# Altium project LPCB219__RLOOP__CONTROL_NODE.PrjPCB
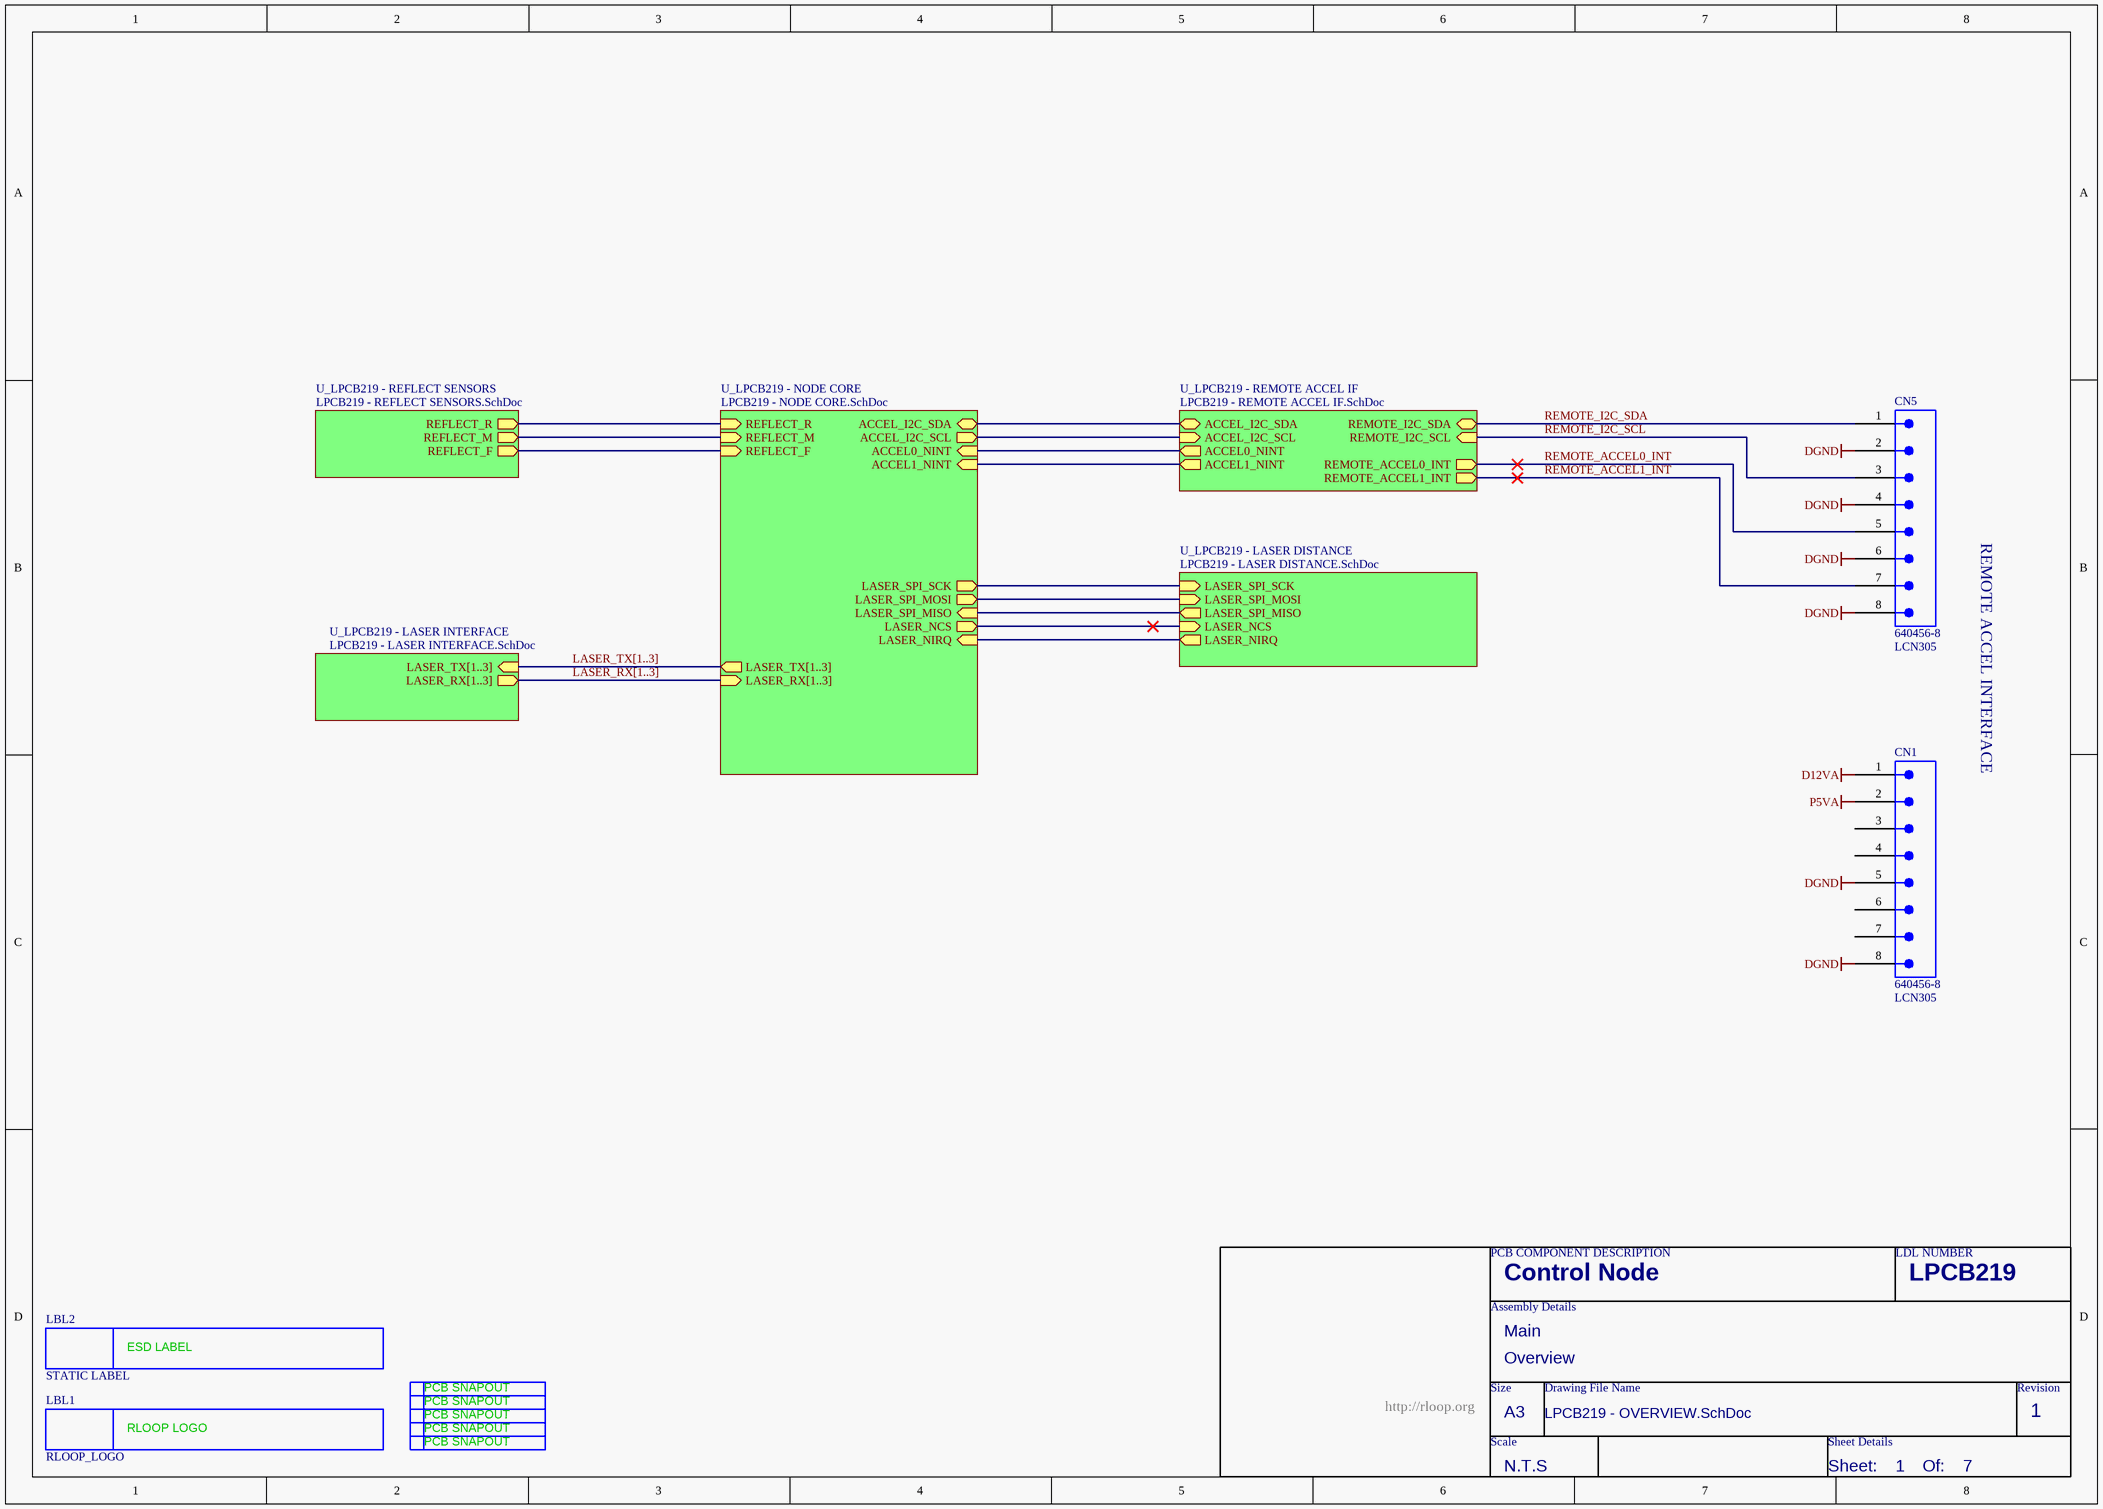
[diagram p0: LPCB219 - OVERVIEW.SchDoc]
7 sheets, 85 parts. Net scope: hierarchical (ports join the sheet entries above them; power ports are global).
Board files: LPCB219R0.PcbDoc, LPCB219R0__ASCII.PcbDoc
Sheets:
  LPCB219 - OVERVIEW.SchDoc
    U_LPCB219 - LASER INTERFACE = LPCB219 - LASER INTERFACE.SchDoc
      L1 = LPCB219 - LASER CHANNEL.SchDoc
      L2 = LPCB219 - LASER CHANNEL.SchDoc
      L3 = LPCB219 - LASER CHANNEL.SchDoc
    U_LPCB219 - REFLECT SENSORS = LPCB219 - REFLECT SENSORS.SchDoc
    U_LPCB219 - LASER DISTANCE = LPCB219 - LASER DISTANCE.SchDoc
    U_LPCB219 - NODE CORE = LPCB219 - NODE CORE.SchDoc
    U_LPCB219 - REMOTE ACCEL IF = LPCB219 - REMOTE ACCEL IF.SchDoc

## Sheet LPCB219 - OVERVIEW.SchDoc
size A3; Address1: Factory 10; Address2: 9-13 Dingley Avenue, Dandeong, VICTORIA 3175, AUSTRALIA; DocumentNumber: 1; Revision: 1; SheetNumber: 1; SheetTotal: 7; Lockie__PCB_SUB_ASSEMBLY: Overview; Lockie__PCB_ASSEMBLY: Main; Lockie__LDL: LPCB219; Lockie__PCB_DESCRIPTION: Control Node

### Parts
CN1  640456-8  LDL_NUMBER: LCN305  [640456-8]
CN5  640456-8  LDL_NUMBER: LCN305  [640456-8]
LBL1  RLOOP_LOGO  [RLOOP_LOGO]  (no BOM)
LBL2  STATIC LABEL  [STATIC_LABEL]  (no BOM)
SN2  PCB_SNAPOUT  [SNAPOUT_NEW]  (value not drawn)  (no BOM)
SN3  PCB_SNAPOUT  [SNAPOUT_NEW]  (value not drawn)  (no BOM)
SN4  PCB_SNAPOUT  [SNAPOUT_NEW]  (value not drawn)  (no BOM)
SN5  PCB_SNAPOUT  [SNAPOUT_NEW]  (value not drawn)  (no BOM)
SN6  PCB_SNAPOUT  [SNAPOUT_NEW]  (value not drawn)  (no BOM)

### Sub-sheets
U_LPCB219 - LASER DISTANCE = LPCB219 - LASER DISTANCE.SchDoc: LASER_NIRQ (out), LASER_NCS (in), LASER_SPI_SCK (in), LASER_SPI_MOSI (in), LASER_SPI_MISO (out)
U_LPCB219 - LASER INTERFACE = LPCB219 - LASER INTERFACE.SchDoc: LASER_TX[1..3] (in), LASER_RX[1..3] (out)
U_LPCB219 - NODE CORE = LPCB219 - NODE CORE.SchDoc: ACCEL_I2C_SDA (bidir), ACCEL_I2C_SCL (out), LASER_SPI_MOSI (out), LASER_SPI_MISO (in), LASER_SPI_SCK (out), ACCEL0_NINT (in), ACCEL1_NINT (in), REFLECT_R (in), LASER_NCS (out), LASER_NIRQ (in), REFLECT_M (in), REFLECT_F (in), LASER_TX[1..3] (out), LASER_RX[1..3] (in)
U_LPCB219 - REFLECT SENSORS = LPCB219 - REFLECT SENSORS.SchDoc: REFLECT_R (out), REFLECT_M (out), REFLECT_F (out)
U_LPCB219 - REMOTE ACCEL IF = LPCB219 - REMOTE ACCEL IF.SchDoc: REMOTE_I2C_SDA (bidir), REMOTE_I2C_SCL (in), ACCEL_I2C_SCL (in), ACCEL_I2C_SDA (bidir), ACCEL0_NINT (out), ACCEL1_NINT (out), REMOTE_ACCEL0_INT (out), REMOTE_ACCEL1_INT (out)

### Nets
D12VA: CN1.1
DGND: CN1.5 CN1.8 CN5.2 CN5.4 CN5.6 CN5.8
P5VA: CN1.2
ACCEL0_NINT: sheet U_LPCB219 - NODE CORE/ACCEL0_NINT, sheet U_LPCB219 - REMOTE ACCEL IF/ACCEL0_NINT
ACCEL1_NINT: sheet U_LPCB219 - NODE CORE/ACCEL1_NINT, sheet U_LPCB219 - REMOTE ACCEL IF/ACCEL1_NINT
ACCEL_I2C_SCL: sheet U_LPCB219 - NODE CORE/ACCEL_I2C_SCL, sheet U_LPCB219 - REMOTE ACCEL IF/ACCEL_I2C_SCL
ACCEL_I2C_SDA: sheet U_LPCB219 - NODE CORE/ACCEL_I2C_SDA, sheet U_LPCB219 - REMOTE ACCEL IF/ACCEL_I2C_SDA
LASER_NCS: sheet U_LPCB219 - LASER DISTANCE/LASER_NCS, sheet U_LPCB219 - NODE CORE/LASER_NCS
LASER_SPI_MISO: sheet U_LPCB219 - LASER DISTANCE/LASER_SPI_MISO, sheet U_LPCB219 - NODE CORE/LASER_SPI_MISO
LASER_SPI_MOSI: sheet U_LPCB219 - LASER DISTANCE/LASER_SPI_MOSI, sheet U_LPCB219 - NODE CORE/LASER_SPI_MOSI
LASER_SPI_SCK: sheet U_LPCB219 - LASER DISTANCE/LASER_SPI_SCK, sheet U_LPCB219 - NODE CORE/LASER_SPI_SCK
REMOTE_ACCEL0_INT: CN5.5 ; sheet U_LPCB219 - REMOTE ACCEL IF/REMOTE_ACCEL0_INT
REMOTE_ACCEL1_INT: CN5.7 ; sheet U_LPCB219 - REMOTE ACCEL IF/REMOTE_ACCEL1_INT
REMOTE_I2C_SCL: CN5.3 ; sheet U_LPCB219 - REMOTE ACCEL IF/REMOTE_I2C_SCL
REMOTE_I2C_SDA: CN5.1 ; sheet U_LPCB219 - REMOTE ACCEL IF/REMOTE_I2C_SDA
NetCN4_T20: sheet U_LPCB219 - REFLECT SENSORS/REFLECT_R, sheet U_LPCB219 - NODE CORE/REFLECT_R
NetCN4_T22: sheet U_LPCB219 - LASER DISTANCE/LASER_NIRQ, sheet U_LPCB219 - NODE CORE/LASER_NIRQ
NetCN4_T24: sheet U_LPCB219 - REFLECT SENSORS/REFLECT_M, sheet U_LPCB219 - NODE CORE/REFLECT_M
NetCN4_T27: sheet U_LPCB219 - REFLECT SENSORS/REFLECT_F, sheet U_LPCB219 - NODE CORE/REFLECT_F

Not connected (* = marked no-connect by the designer): CN1 3 4 6 7

### Buses and harness runs
bus LASER_RX[1..3] = sheet U_LPCB219 - LASER INTERFACE/LASER_RX[1..3] = sheet U_LPCB219 - NODE CORE/LASER_RX[1..3]
bus LASER_TX[1..3] = sheet U_LPCB219 - LASER INTERFACE/LASER_TX[1..3] = sheet U_LPCB219 - NODE CORE/LASER_TX[1..3]

### Notes on the sheet
- REMOTE ACCEL INTERFACE
- PCB COMPONENT DESCRIPTION
- LDL NUMBER
- Assembly Details
- Size
- Drawing File Name
- Revision
- http://rloop.org
- Scale
- A3
- Sheet Details
- N.T.S
- Sheet:
- Of:
- (in symbol PCB_SNAPOUT) PCB SNAPOUT
- (in symbol RLOOP_LOGO) RLOOP LOGO
- (in symbol STATIC LABEL) ESD LABEL

### Library data of the parts
CN1 CN5 = 640456-8: Connector, Male Header, 8 Way; FMEDA__CHANNEL: COM; FMEDA__OPERATING__CURRENT_MAX: 0; FMEDA__OPERATING__TEMP_MAX: 50; FMEDA__OPERATING__TEMP_MIN: -20; FMEDA__OPERATING__TEMP_TYP: 27; FMEDA__OPERATING__VOLTAGE_MAX: 16; FMEDA__OPERATING__VOLTAGE_TYP: 12; FMEDA__FUNCTION_IN_SYSTEM: *; FMEDA__OPERATING__CURRENT_MIN: 0; FMEDA__OPERATING__CURRENT_TYP: 0; FMEDA__OPERATING__VOLTAGE_MIN: 0
LBL1 = RLOOP_LOGO: FMEDA__CHANNEL: DIAG; FMEDA__FUNCTION_IN_SYSTEM: *
LBL2 = STATIC LABEL: FMEDA__CHANNEL: DIAG; FMEDA__FUNCTION_IN_SYSTEM: *
SN2-SN6 = PCB_SNAPOUT: FMEDA__CHANNEL: DIAG; FMEDA__FUNCTION_IN_SYSTEM: *

## Sheet LPCB219 - LASER INTERFACE.SchDoc
size A3; Address1: Factory 10; Address2: 9-13 Dingley Avenue, Dandeong, VICTORIA 3175, AUSTRALIA; DocumentNumber: 3; Revision: 1; SheetNumber: 3; SheetTotal: 7; Lockie__PCB_SUB_ASSEMBLY: Laser Interface; Lockie__PCB_ASSEMBLY: Main; Lockie__LDL: LPCB219; Lockie__PCB_DESCRIPTION: Control Node
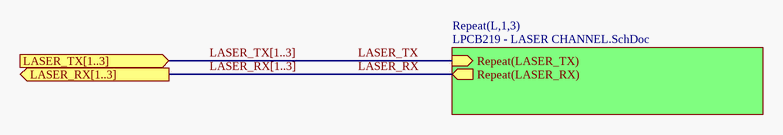
[diagram p1: LPCB219 - LASER INTERFACE.SchDoc]

### Sub-sheets
Repeat(L,1,3) = LPCB219 - LASER CHANNEL.SchDoc: Repeat(LASER_RX) (out), Repeat(LASER_TX) (in)

### Ports
LASER_RX[1..3] (out), LASER_TX[1..3] (in)

### Nets
LASER_RX: sheet Repeat(L,1,3)/Repeat(LASER_RX)
LASER_TX: sheet Repeat(L,1,3)/Repeat(LASER_TX)

### Buses and harness runs
bus LASER_RX[1..3] = port LASER_RX[1..3]
bus LASER_TX[1..3] = port LASER_TX[1..3]

### Notes on the sheet
- PCB COMPONENT DESCRIPTION
- LDL NUMBER
- Assembly Details
- Size
- Drawing File Name
- Revision
- http://rloop.org
- Scale
- A3
- Sheet Details
- N.T.S
- Sheet:
- Of:

## Sheet LPCB219 - LASER CHANNEL.SchDoc
size A3; Address1: Factory 10; Address2: 9-13 Dingley Avenue, Dandeong, VICTORIA 3175, AUSTRALIA; DocumentNumber: 4; Revision: 1; SheetNumber: 4; SheetTotal: 7; Lockie__PCB_SUB_ASSEMBLY: Laser Channel; Lockie__PCB_ASSEMBLY: Main; Lockie__LDL: LPCB219; Lockie__PCB_DESCRIPTION: Control Node
Used 3 times, as channels U_LPCB219 - LASER INTERFACE/L1, U_LPCB219 - LASER INTERFACE/L2, U_LPCB219 - LASER INTERFACE/L3. Parts and nets are listed once, with the designators drawn on the sheet.
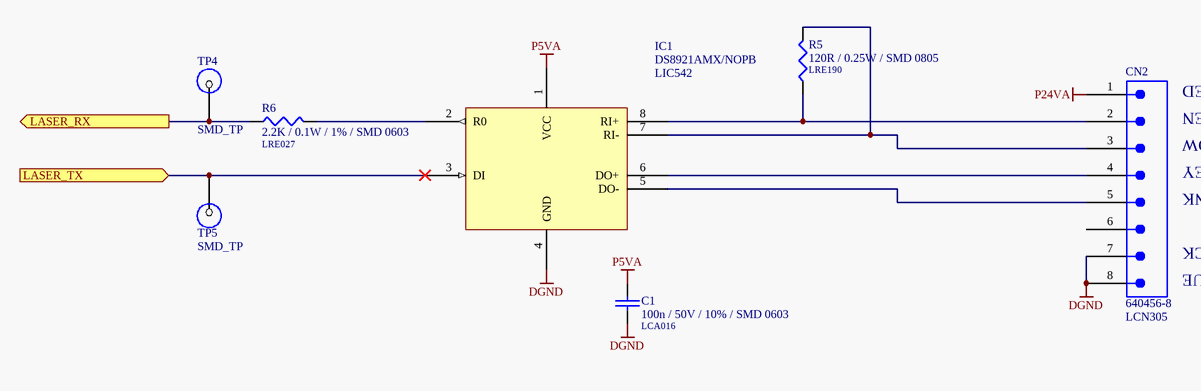
[diagram p2: LPCB219 - LASER CHANNEL.SchDoc]

### Parts
C1  100n / 50V / 10% / SMD 0603  LDL_NUMBER: LCA016  [LFP011__CC1608-0603-IPC7351_B]
CN2  640456-8  LDL_NUMBER: LCN305  [640456-8]
IC1  DS8921AMX/NOPB  LDL_NUMBER: LIC542  [LFP069__R-8G]
R5  120R / 0.25W / SMD 0805  LDL_NUMBER: LRE190  [LFP029__CR2012-0805]
R6  2.2K / 0.1W / 1% / SMD 0603  LDL_NUMBER: LRE027  [LFP020__CR1608-0603-IPC7351_B]
TP4  SMD_TP  [SMD-TP]  (no BOM)
TP5  SMD_TP  [SMD-TP]  (no BOM)

### Ports
LASER_RX (out), LASER_TX (in)

### Nets
DGND: C1.2 CN2.7 CN2.8 IC1.4(GND)
P5VA: C1.1 IC1.1(VCC)
P24VA: CN2.1
LASER_RX: R6.1 TP4.1 ; port LASER_RX
LASER_TX: IC1.3(DI) TP5.1 ; port LASER_TX
NetCN2_2: CN2.2 IC1.8(RI+) R5.1
NetCN2_3: CN2.3 IC1.7(RI-) R5.2
NetCN2_4: CN2.4 IC1.6(DO+)
NetCN2_5: CN2.5 IC1.5(DO-)
NetIC1_2: IC1.2(R0) R6.2

Not connected (* = marked no-connect by the designer): CN2 6

### Channels
U_LPCB219 - LASER INTERFACE/L1: designators end in _L1; ports LASER_RX=LASER_RX1 LASER_TX=LASER_TX1
U_LPCB219 - LASER INTERFACE/L2: designators end in _L2; ports LASER_RX=LASER_RX2 LASER_TX=LASER_TX2
U_LPCB219 - LASER INTERFACE/L3: designators end in _L3; ports LASER_RX=LASER_RX3 LASER_TX=LASER_TX3

### Notes on the sheet
- RED
- GREEN
- YELLOW
- GREY
- PINK
- BLACK
- BLUE
- PCB COMPONENT DESCRIPTION
- LDL NUMBER
- Assembly Details
- Size
- Drawing File Name
- Revision
- http://rloop.org
- Scale
- A3
- Sheet Details
- N.T.S
- Sheet:
- Of:

### Library data of the parts
C1 = 100n / 50V / 10% / SMD 0603: Capacitor, Ceramic Chip, 100nF (0.1uF), 50V, 5%, SMD 0603 [LCA016]; FMEDA__OPERATING__VOLTAGE_MIN: 0; FMEDA__OPERATING__VOLTAGE_MAX: 3.3; FMEDA__OPERATING__TEMP_MIN: -20; FMEDA__OPERATING__TEMP_TYP: 27; FMEDA__OPERATING__TEMP_MAX: 50; FMEDA__CHANNEL: COM; Value: 100n; FMEDA__FUNCTION_IN_SYSTEM: *; FMEDA__OPERATING__VOLTAGE_TYP: 3.3
CN2 = 640456-8: as CN1 on sheet LPCB219 - OVERVIEW; FMEDA__FUNCTION_IN_SYSTEM: *; FMEDA__OPERATING__CURRENT_MIN: 0; FMEDA__OPERATING__CURRENT_TYP: 0; FMEDA__OPERATING__VOLTAGE_MIN: 0
IC1 = DS8921AMX/NOPB: IC, RS422 Tx Rx, SMD SOIC 8
R5 = 120R / 0.25W / SMD 0805: Resistor, Thick Film, 120R, 0.25W, 5%, SMD 0805 [LRE190]; Value: 120; FMEDA__OPERATING__POWER_MAX: 0; FMEDA__OPERATING__TEMP_MAX: 155; FMEDA__OPERATING__TEMP_MIN: -55; FMEDA__OPERATING__TEMP_TYP: 27; FMEDA__OPERATING__VOLTAGE_TYP: 150; FMEDA__CHANNEL: COM; FMEDA__OPERATING__POWER_MIN: 0; FMEDA__OPERATING__VOLTAGE_MAX: 0; FMEDA__OPERATING__VOLTAGE_MIN: 0; FMEDA__FUNCTION_IN_SYSTEM: *
R6 = 2.2K / 0.1W / 1% / SMD 0603: Resistor, Ceramic Chip, 2.2K, 0.1W, 1%, SMD 0603 [LRE027]; FMEDA__OPERATING__VOLTAGE_MIN: 0; FMEDA__OPERATING__TEMP_MIN: -20; FMEDA__OPERATING__TEMP_TYP: 27; FMEDA__OPERATING__TEMP_MAX: 50; FMEDA__CHANNEL: COM; VALUE: 2.2K; FMEDA__OPERATING__VOLTAGE_MAX: 0; FMEDA__OPERATING__POWER_MIN: 0; FMEDA__OPERATING__POWER_MAX: 0; FMEDA__FUNCTION_IN_SYSTEM: *; FMEDA__OPERATING__VOLTAGE_TYP: 0
TP4 TP5 = SMD_TP: SMD Test Point; FMEDA__CHANNEL: COM; FMEDA__OPERATING__CURRENT_MAX: 0; FMEDA__OPERATING__TEMP_MAX: 50; FMEDA__OPERATING__TEMP_MIN: -20; FMEDA__OPERATING__TEMP_TYP: 27; FMEDA__OPERATING__VOLTAGE_MAX: 16; FMEDA__OPERATING__VOLTAGE_TYP: 12; FMEDA__OPERATING__CURRENT_MIN: 0; FMEDA__OPERATING__CURRENT_TYP: 0; FMEDA__OPERATING__VOLTAGE_MIN: 0

## Sheet LPCB219 - REFLECT SENSORS.SchDoc
size A3; Address1: Factory 10; Address2: 9-13 Dingley Avenue, Dandeong, VICTORIA 3175, AUSTRALIA; DocumentNumber: 6; Revision: 1; SheetNumber: 6; SheetTotal: 7; Lockie__PCB_SUB_ASSEMBLY: Reflect Sensors; Lockie__PCB_ASSEMBLY: Main; Lockie__LDL: LPCB219; Lockie__PCB_DESCRIPTION: Control Node
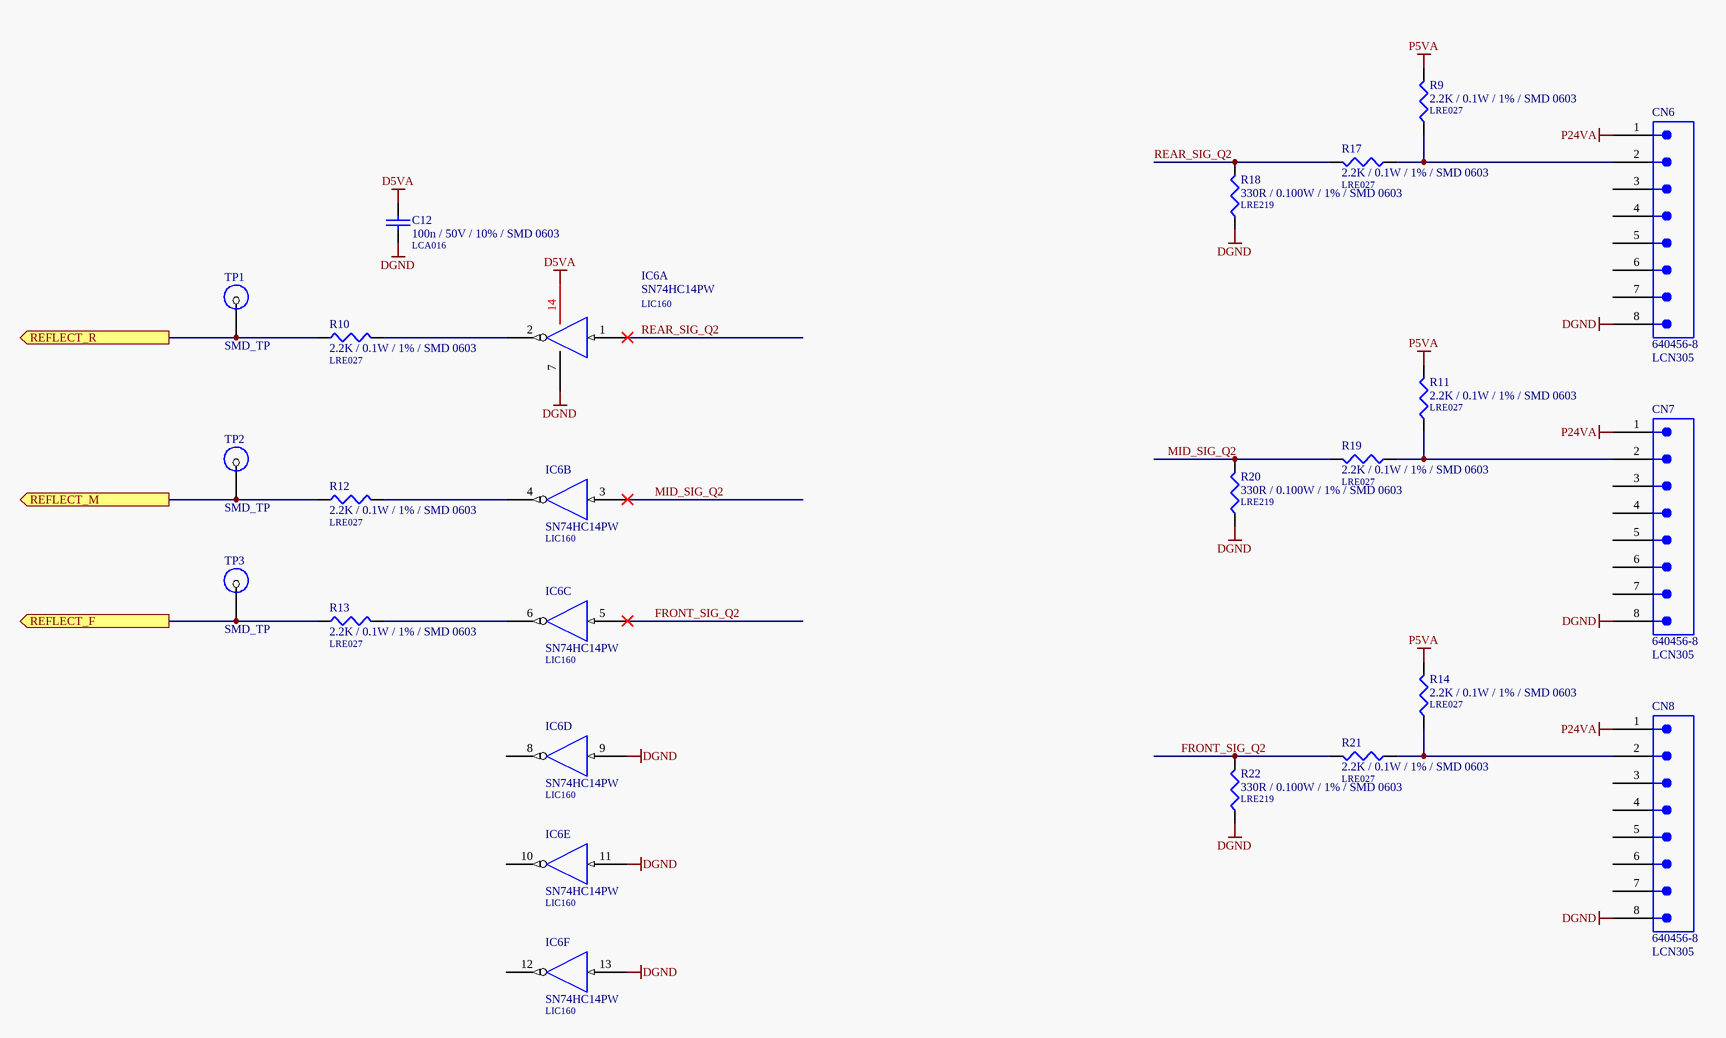
[diagram p3: LPCB219 - REFLECT SENSORS.SchDoc]

### Parts
C12  100n / 50V / 10% / SMD 0603  LDL_NUMBER: LCA016  [LFP011__CC1608-0603-IPC7351_B]
CN6  640456-8  LDL_NUMBER: LCN305  [640456-8]
CN7  640456-8  LDL_NUMBER: LCN305  [640456-8]
CN8  640456-8  LDL_NUMBER: LCN305  [640456-8]
IC6  SN74HC14PW  LDL_NUMBER: LIC160  [PW014]  (parts A,B,C,D,E,F of 6)
R9  2.2K / 0.1W / 1% / SMD 0603  LDL_NUMBER: LRE027  [LFP020__CR1608-0603-IPC7351_B]
R10  2.2K / 0.1W / 1% / SMD 0603  LDL_NUMBER: LRE027  [LFP020__CR1608-0603-IPC7351_B]
R11  2.2K / 0.1W / 1% / SMD 0603  LDL_NUMBER: LRE027  [LFP020__CR1608-0603-IPC7351_B]
R12  2.2K / 0.1W / 1% / SMD 0603  LDL_NUMBER: LRE027  [LFP020__CR1608-0603-IPC7351_B]
R13  2.2K / 0.1W / 1% / SMD 0603  LDL_NUMBER: LRE027  [LFP020__CR1608-0603-IPC7351_B]
R14  2.2K / 0.1W / 1% / SMD 0603  LDL_NUMBER: LRE027  [LFP020__CR1608-0603-IPC7351_B]
R17  2.2K / 0.1W / 1% / SMD 0603  LDL_NUMBER: LRE027  [LFP020__CR1608-0603-IPC7351_B]
R18  330R / 0.100W / 1% / SMD 0603  LDL_NUMBER: LRE219  [LFP020__CR1608-0603-IPC7351_B]
R19  2.2K / 0.1W / 1% / SMD 0603  LDL_NUMBER: LRE027  [LFP020__CR1608-0603-IPC7351_B]
R20  330R / 0.100W / 1% / SMD 0603  LDL_NUMBER: LRE219  [LFP020__CR1608-0603-IPC7351_B]
R21  2.2K / 0.1W / 1% / SMD 0603  LDL_NUMBER: LRE027  [LFP020__CR1608-0603-IPC7351_B]
R22  330R / 0.100W / 1% / SMD 0603  LDL_NUMBER: LRE219  [LFP020__CR1608-0603-IPC7351_B]
TP1  SMD_TP  [SMD-TP]  (no BOM)
TP2  SMD_TP  [SMD-TP]  (no BOM)
TP3  SMD_TP  [SMD-TP]  (no BOM)

### Ports
REFLECT_F (out), REFLECT_M (out), REFLECT_R (out)

### Nets
D5VA: C12.1 IC6.14(VCC)
DGND: C12.2 CN6.8 CN7.8 CN8.8 IC6.7(GND) IC6.9(A) IC6.11(A) IC6.13(A) R18.1 R20.1 R22.1
P5VA: R9.2 R11.2 R14.2
P24VA: CN6.1 CN7.1 CN8.1
FRONT_SIG_Q2: IC6.5(A) R21.2 R22.2
MID_SIG_Q2: IC6.3(A) R19.2 R20.2
REAR_SIG_Q2: IC6.1(A) R17.2 R18.2
NetCN4_T20: R10.1 TP1.1 ; port REFLECT_R
NetCN4_T24: R12.1 TP2.1 ; port REFLECT_M
NetCN4_T27: R13.1 TP3.1 ; port REFLECT_F
NetCN6_2: CN6.2 R9.1 R17.1
NetCN7_2: CN7.2 R11.1 R19.1
NetCN8_2: CN8.2 R14.1 R21.1
NetIC6_2: IC6.2(Y) R10.2
NetIC6_4: IC6.4(Y) R12.2
NetIC6_6: IC6.6(Y) R13.2

Not connected (* = marked no-connect by the designer): CN6 3 4 5 6 7; CN7 3 4 5 6 7; CN8 3 4 5 6 7; IC6 8(Y) 10(Y) 12(Y)

### Notes on the sheet
- PCB COMPONENT DESCRIPTION
- LDL NUMBER
- Assembly Details
- Size
- Drawing File Name
- Revision
- http://rloop.org
- Scale
- A3
- Sheet Details
- N.T.S
- Sheet:
- Of:

### Library data of the parts
C12 = 100n / 50V / 10% / SMD 0603: as C1 on sheet LPCB219 - LASER CHANNEL; Value: 100n; FMEDA__FUNCTION_IN_SYSTEM: *; FMEDA__OPERATING__VOLTAGE_TYP: 3.3
CN6-CN8 = 640456-8: as CN1 on sheet LPCB219 - OVERVIEW; FMEDA__FUNCTION_IN_SYSTEM: *; FMEDA__OPERATING__CURRENT_MIN: 0; FMEDA__OPERATING__CURRENT_TYP: 0; FMEDA__OPERATING__VOLTAGE_MIN: 0
IC6 = SN74HC14PW: IC, Hex Inveter, Schmitt Trigger, SMD [LIC160]; FMEDA__OPERATING__TEMP_MAX: 50; FMEDA__OPERATING__TEMP_MIN: -20; FMEDA__OPERATING__TEMP_TYP: 27; FMEDA__CHANNEL: COM; Revision: 17-Jul-2002: Re-released for DXP Platform.
R9-R14 R17 R19 R21 = 2.2K / 0.1W / 1% / SMD 0603: as R6 on sheet LPCB219 - LASER CHANNEL; VALUE: 2.2K; FMEDA__OPERATING__VOLTAGE_MAX: 0; FMEDA__OPERATING__POWER_MIN: 0; FMEDA__OPERATING__POWER_MAX: 0; FMEDA__FUNCTION_IN_SYSTEM: *; FMEDA__OPERATING__VOLTAGE_TYP: 0
R18 R20 R22 = 330R / 0.100W / 1% / SMD 0603: Resistor, Thick Film, 330R, 0.100W, 75V, 1%, SMD 0603 [LRE219]; VALUE: 330; FMEDA__OPERATING__POWER_MAX: 0.1; FMEDA__OPERATING__POWER_MIN: 0; FMEDA__OPERATING__VOLTAGE_MAX: 75; FMEDA__OPERATING__TEMP_MAX: 155; FMEDA__OPERATING__TEMP_MIN: -55; FMEDA__OPERATING__TEMP_TYP: 27; FMEDA__CHANNEL: COM; FMEDA__OPERATING__VOLTAGE_MIN: 0; FMEDA__OPERATING__VOLTAGE_TYP: 75; FMEDA__FUNCTION_IN_SYSTEM: *
TP1-TP3 = SMD_TP: as TP4 on sheet LPCB219 - LASER CHANNEL; FMEDA__OPERATING__CURRENT_MIN: 0; FMEDA__OPERATING__CURRENT_TYP: 0; FMEDA__OPERATING__VOLTAGE_MIN: 0

## Sheet LPCB219 - LASER DISTANCE.SchDoc
size A3; Address1: Factory 10; Address2: 9-13 Dingley Avenue, Dandeong, VICTORIA 3175, AUSTRALIA; DocumentNumber: 2; Revision: 1; SheetNumber: 2; SheetTotal: 7; Lockie__PCB_SUB_ASSEMBLY: Laser Distance; Lockie__PCB_ASSEMBLY: Main; Lockie__LDL: LPCB219; Lockie__PCB_DESCRIPTION: Control Node
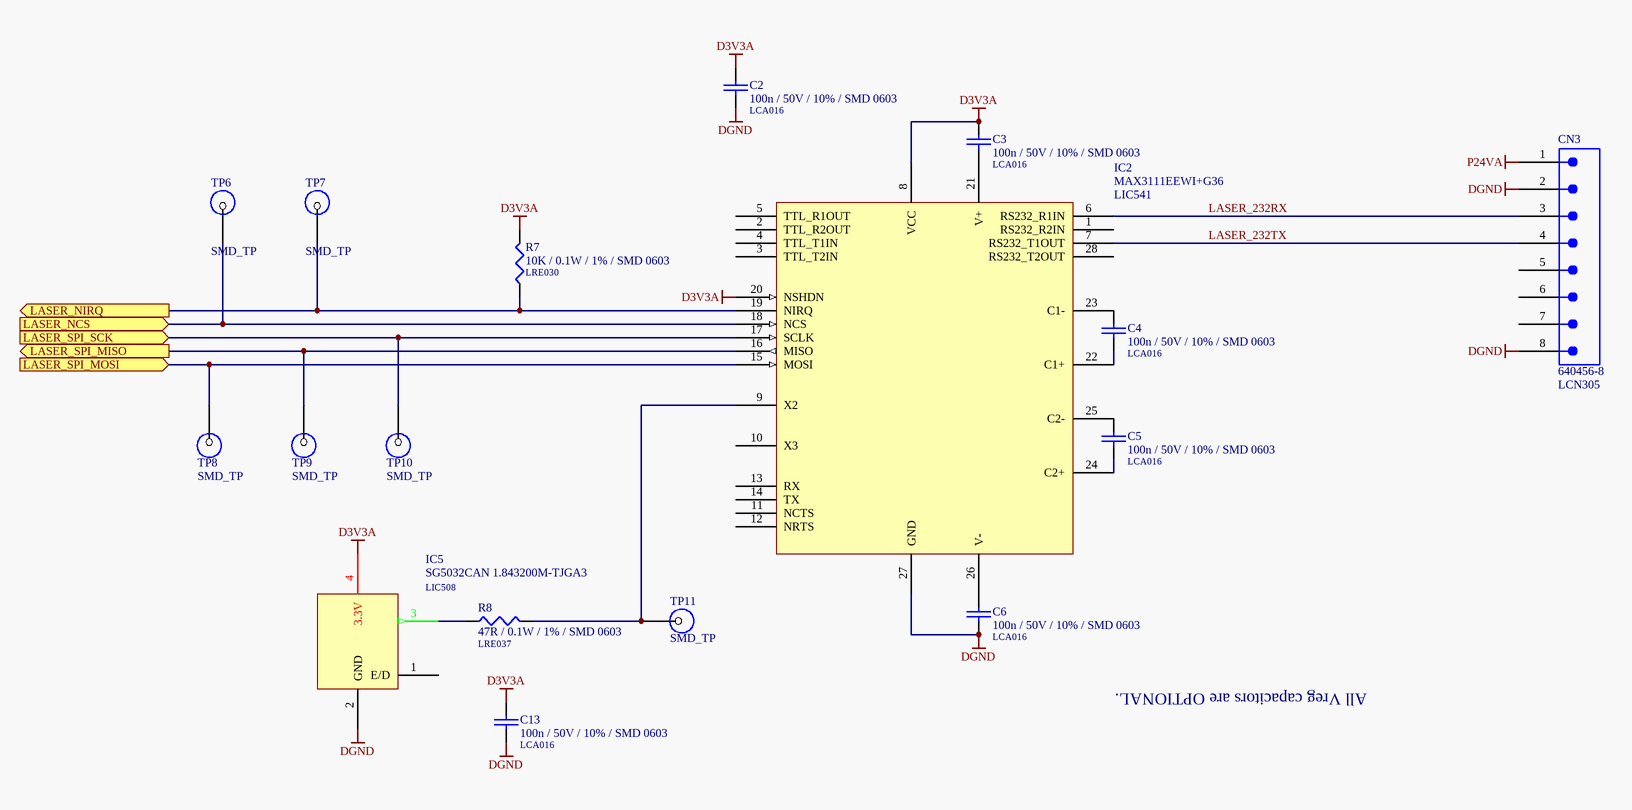
[diagram p4: LPCB219 - LASER DISTANCE.SchDoc]

### Parts
C2  100n / 50V / 10% / SMD 0603  LDL_NUMBER: LCA016  [LFP011__CC1608-0603-IPC7351_B]
C3  100n / 50V / 10% / SMD 0603  LDL_NUMBER: LCA016  [LFP011__CC1608-0603-IPC7351_B]
C4  100n / 50V / 10% / SMD 0603  LDL_NUMBER: LCA016  [LFP011__CC1608-0603-IPC7351_B]
C5  100n / 50V / 10% / SMD 0603  LDL_NUMBER: LCA016  [LFP011__CC1608-0603-IPC7351_B]
C6  100n / 50V / 10% / SMD 0603  LDL_NUMBER: LCA016  [LFP011__CC1608-0603-IPC7351_B]
C13  100n / 50V / 10% / SMD 0603  LDL_NUMBER: LCA016  [LFP011__CC1608-0603-IPC7351_B]
CN3  640456-8  LDL_NUMBER: LCN305  [640456-8]
IC2  MAX3111EEWI+G36  LDL_NUMBER: LIC541  [LFP024__SOIC300-28]
IC5  SG5032CAN 1.843200M-TJGA3  LDL_NUMBER: LIC508  [LFP072__ASFLMB]
R7  10K / 0.1W / 1% / SMD 0603  LDL_NUMBER: LRE030  [LFP020__CR1608-0603-IPC7351_B]
R8  47R / 0.1W / 1% / SMD 0603  LDL_NUMBER: LRE037  [LFP020__CR1608-0603-IPC7351_B]
TP6  SMD_TP  [SMD-TP]  (no BOM)
TP7  SMD_TP  [SMD-TP]  (no BOM)
TP8  SMD_TP  [SMD-TP]  (no BOM)
TP9  SMD_TP  [SMD-TP]  (no BOM)
TP10  SMD_TP  [SMD-TP]  (no BOM)
TP11  SMD_TP  [SMD-TP]  (no BOM)

### Ports
LASER_NCS (in), LASER_NIRQ (out), LASER_SPI_MISO (out), LASER_SPI_MOSI (in), LASER_SPI_SCK (in)

### Nets
D3V3A: C2.1 C3.1 C13.1 IC2.8(VCC) IC2.20(NSHDN) IC5.4(3.3V) R7.2
DGND: C2.2 C6.2 C13.2 CN3.2 CN3.8 IC2.27(GND) IC5.2(GND)
P24VA: CN3.1
LASER_232RX: CN3.3 IC2.6(RS232_R1IN)
LASER_232TX: CN3.4 IC2.7(RS232_T1OUT)
LASER_NCS: IC2.18(NCS) TP6.1 ; port LASER_NCS
LASER_SPI_MISO: IC2.16(MISO) TP9.1 ; port LASER_SPI_MISO
LASER_SPI_MOSI: IC2.15(MOSI) TP8.1 ; port LASER_SPI_MOSI
LASER_SPI_SCK: IC2.17(SCLK) TP10.1 ; port LASER_SPI_SCK
NetC3_2: C3.2 IC2.21(V+)
NetC4_1: C4.1 IC2.23(C1-)
NetC4_2: C4.2 IC2.22(C1+)
NetC5_1: C5.1 IC2.25(C2-)
NetC5_2: C5.2 IC2.24(C2+)
NetC6_1: C6.1 IC2.26(V-)
NetCN4_T22: IC2.19(NIRQ) R7.1 TP7.1 ; port LASER_NIRQ
NetIC2_9: IC2.9(X2) R8.2 TP11.1
NetIC5_3: IC5.3(OUT) R8.1

Not connected (* = marked no-connect by the designer): CN3 5 6 7; IC2 1(RS232_R2IN) 2(TTL_R2OUT) 3(TTL_T2IN) 4(TTL_T1IN) 5(TTL_R1OUT) 10(X3) 11(NCTS) 12(NRTS) 13(RX) 14(TX) 28(RS232_T2OUT); IC5 1(E/D)

### Notes on the sheet
- All Vreg capacitors are OPTIONAL.
- PCB COMPONENT DESCRIPTION
- LDL NUMBER
- Assembly Details
- Size
- Drawing File Name
- Revision
- http://rloop.org
- Scale
- A3
- Sheet Details
- N.T.S
- Sheet:
- Of:

### Library data of the parts
C2-C6 C13 = 100n / 50V / 10% / SMD 0603: as C1 on sheet LPCB219 - LASER CHANNEL; Value: 100n; FMEDA__FUNCTION_IN_SYSTEM: *; FMEDA__OPERATING__VOLTAGE_TYP: 3.3
CN3 = 640456-8: as CN1 on sheet LPCB219 - OVERVIEW; FMEDA__FUNCTION_IN_SYSTEM: *; FMEDA__OPERATING__CURRENT_MIN: 0; FMEDA__OPERATING__CURRENT_TYP: 0; FMEDA__OPERATING__VOLTAGE_MIN: 0
IC2 = MAX3111EEWI+G36: IC, SPI UART Interface, SMD SOIC28 [LIC541]
IC5 = SG5032CAN 1.843200M-TJGA3: IC, Oscillator Module, 1.8432MHz, 3.3V, SMD [LIC508]; FMEDA__OPERATING__TEMP_MAX: 50; FMEDA__OPERATING__TEMP_MIN: -20; FMEDA__OPERATING__TEMP_TYP: 27; FMEDA__OPERATING__VOLTAGE_MAX: 3.3; FMEDA__OPERATING__VOLTAGE_MIN: 0; FMEDA__CHANNEL: COM; FMEDA__OPERATING__VOLTAGE_TYP: 3.3; FMEDA__FUNCTION_IN_SYSTEM: *
R7 = 10K / 0.1W / 1% / SMD 0603: Resistor, Ceramic Chip, 10K, 0.1W, 1%, SMD 0603 [LRE030]; FMEDA__OPERATING__POWER_MAX: 0; FMEDA__OPERATING__TEMP_MAX: 50; FMEDA__OPERATING__TEMP_MIN: -20; FMEDA__OPERATING__TEMP_TYP: 27; FMEDA__CHANNEL: COM; Value: 10K; FMEDA__OPERATING__POWER_MIN: 0; FMEDA__OPERATING__VOLTAGE_MAX: 0; FMEDA__OPERATING__VOLTAGE_MIN: 0; FMEDA__OPERATING__VOLTAGE_TYP: 0; FMEDA__FUNCTION_IN_SYSTEM: *
R8 = 47R / 0.1W / 1% / SMD 0603: Resistor, Ceramic Chip, 47R, 0.1W, 1%, SMD 0603 [LRE037]; VALUE: 47; FMEDA__OPERATING__POWER_MAX: 0; FMEDA__OPERATING__TEMP_MAX: 50; FMEDA__OPERATING__TEMP_MIN: -20; FMEDA__OPERATING__TEMP_TYP: 27; FMEDA__CHANNEL: COM; FMEDA__OPERATING__POWER_MIN: 0; FMEDA__OPERATING__VOLTAGE_MAX: 0; FMEDA__OPERATING__VOLTAGE_MIN: 0; FMEDA__OPERATING__VOLTAGE_TYP: 0; FMEDA__FUNCTION_IN_SYSTEM: *
TP6-TP11 = SMD_TP: as TP4 on sheet LPCB219 - LASER CHANNEL; FMEDA__OPERATING__CURRENT_MIN: 0; FMEDA__OPERATING__CURRENT_TYP: 0; FMEDA__OPERATING__VOLTAGE_MIN: 0

## Sheet LPCB219 - NODE CORE.SchDoc
size A3; Address1: Factory 10; Address2: 9-13 Dingley Avenue, Dandeong, VICTORIA 3175, AUSTRALIA; DocumentNumber: 5; Revision: 1; SheetNumber: 5; SheetTotal: 7; Lockie__PCB_SUB_ASSEMBLY: Core; Lockie__PCB_ASSEMBLY: Main; Lockie__LDL: LPCB219; Lockie__PCB_DESCRIPTION: Control Node
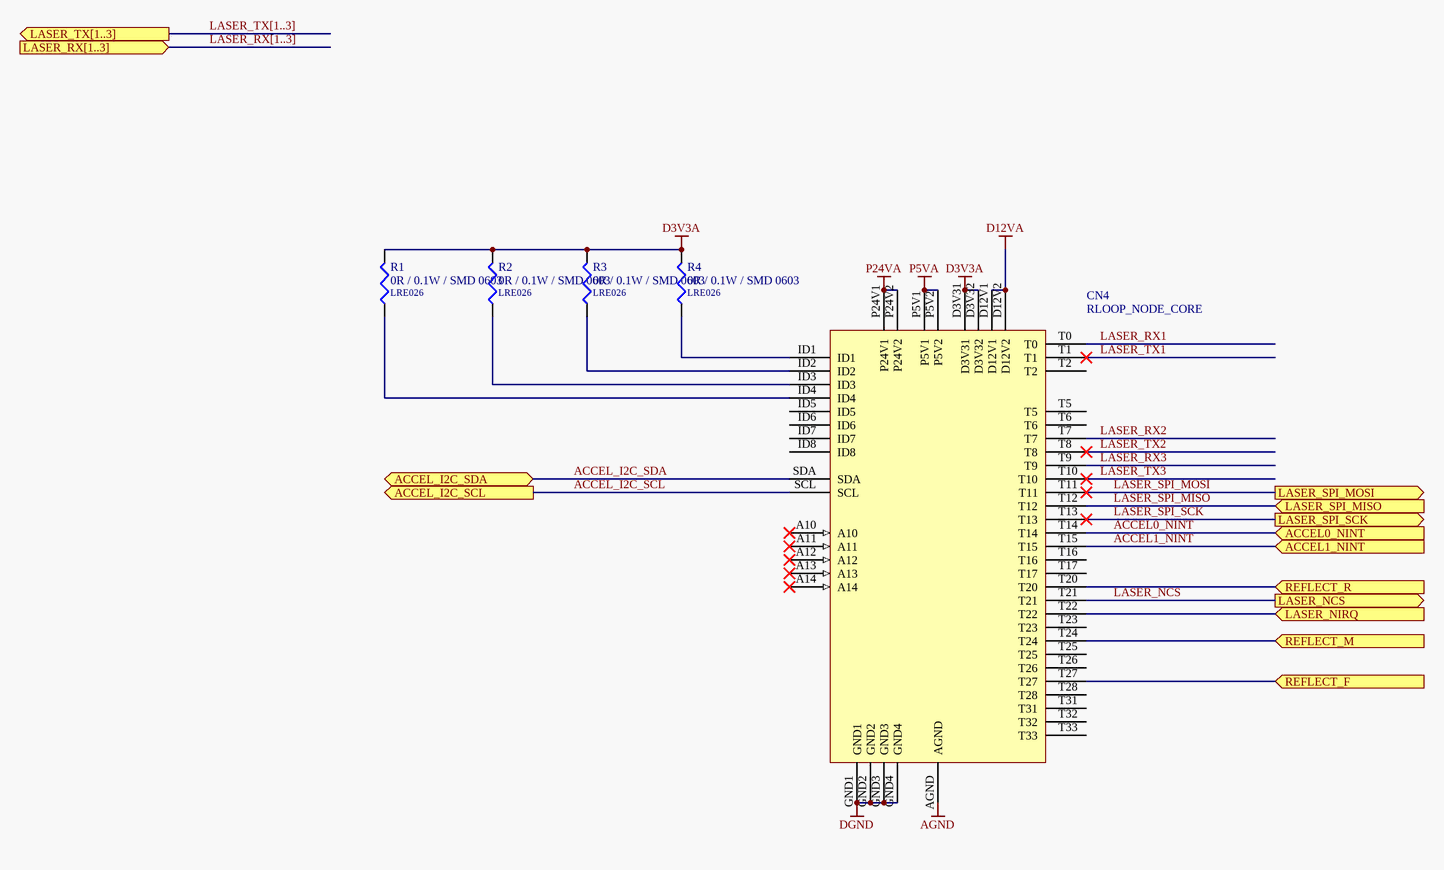
[diagram p5: LPCB219 - NODE CORE.SchDoc]

### Parts
CN4  RLOOP_NODE_CORE  [RLOOP_NODE_CORE]  (no BOM)
R1  0R / 0.1W / SMD 0603  LDL_NUMBER: LRE026  [LFP020__CR1608-0603-IPC7351_B]
R2  0R / 0.1W / SMD 0603  LDL_NUMBER: LRE026  [LFP020__CR1608-0603-IPC7351_B]
R3  0R / 0.1W / SMD 0603  LDL_NUMBER: LRE026  [LFP020__CR1608-0603-IPC7351_B]
R4  0R / 0.1W / SMD 0603  LDL_NUMBER: LRE026  [LFP020__CR1608-0603-IPC7351_B]

### Ports
ACCEL0_NINT (in), ACCEL1_NINT (in), ACCEL_I2C_SCL (out), ACCEL_I2C_SDA (bidir), LASER_NCS (out), LASER_NIRQ (in), LASER_RX[1..3] (in), LASER_SPI_MISO (in), LASER_SPI_MOSI (out), LASER_SPI_SCK (out), LASER_TX[1..3] (out), REFLECT_F (in), REFLECT_M (in), REFLECT_R (in)

### Nets
AGND: CN4.AGND
D3V3A: CN4.D3V31 CN4.D3V32 R1.2 R2.2 R3.2 R4.2
D12VA: CN4.D12V1 CN4.D12V2
DGND: CN4.GND1 CN4.GND2 CN4.GND3 CN4.GND4
P5VA: CN4.P5V1 CN4.P5V2
P24VA: CN4.P24V1 CN4.P24V2
ACCEL0_NINT: CN4.T14 ; port ACCEL0_NINT
ACCEL1_NINT: CN4.T15 ; port ACCEL1_NINT
ACCEL_I2C_SCL: CN4.SCL ; port ACCEL_I2C_SCL
ACCEL_I2C_SDA: CN4.SDA ; port ACCEL_I2C_SDA
LASER_NCS: CN4.T21 ; port LASER_NCS
LASER_RX1: CN4.T0
LASER_RX2: CN4.T7
LASER_RX3: CN4.T9
LASER_SPI_MISO: CN4.T12 ; port LASER_SPI_MISO
LASER_SPI_MOSI: CN4.T11 ; port LASER_SPI_MOSI
LASER_SPI_SCK: CN4.T13 ; port LASER_SPI_SCK
LASER_TX1: CN4.T1
LASER_TX2: CN4.T8
LASER_TX3: CN4.T10
NetCN4_ID1: CN4.ID1 R4.1
NetCN4_ID2: CN4.ID2 R3.1
NetCN4_ID3: CN4.ID3 R2.1
NetCN4_ID4: CN4.ID4 R1.1
NetCN4_T20: CN4.T20 ; port REFLECT_R
NetCN4_T22: CN4.T22 ; port LASER_NIRQ
NetCN4_T24: CN4.T24 ; port REFLECT_M
NetCN4_T27: CN4.T27 ; port REFLECT_F

Not connected (* = marked no-connect by the designer): CN4 A10* A11* A12* A13* A14* ID5 ID6 ID7 ID8 T2 T5 T6 T16 T17 T23 T25 T26 T28 T31 T32 T33

### Buses and harness runs
bus LASER_RX[1..3] = port LASER_RX[1..3]
bus LASER_TX[1..3] = port LASER_TX[1..3]

### Notes on the sheet
- PCB COMPONENT DESCRIPTION
- LDL NUMBER
- Assembly Details
- Size
- Drawing File Name
- Revision
- http://rloop.org
- Scale
- A3
- Sheet Details
- N.T.S
- Sheet:
- Of:

### Library data of the parts
CN4 = RLOOP_NODE_CORE: rLoop Node Core Connector; FMEDA__CHANNEL: COM; FMEDA__OPERATING__CURRENT_MAX: 0; FMEDA__OPERATING__TEMP_MAX: 50; FMEDA__OPERATING__TEMP_MIN: -20; FMEDA__OPERATING__TEMP_TYP: 27; FMEDA__OPERATING__VOLTAGE_MAX: 16; FMEDA__OPERATING__VOLTAGE_TYP: 12; FMEDA__OPERATING__CURRENT_MIN: 0; FMEDA__OPERATING__CURRENT_TYP: 0; FMEDA__OPERATING__VOLTAGE_MIN: 0
R1-R4 = 0R / 0.1W / SMD 0603: Resistor, Ceramic Chip, 0R, 0.1W, SMD 0603 [LRE026]; Value: 0; FMEDA__OPERATING__TEMP_MAX: 50; FMEDA__OPERATING__TEMP_MIN: -20; FMEDA__OPERATING__TEMP_TYP: 27; FMEDA__CHANNEL: COM; FMEDA__OPERATING__POWER_MAX: 0; FMEDA__OPERATING__POWER_MIN: 0; FMEDA__OPERATING__VOLTAGE_MAX: 0; FMEDA__OPERATING__VOLTAGE_MIN: 0; FMEDA__OPERATING__VOLTAGE_TYP: 0; FMEDA__FUNCTION_IN_SYSTEM: *

## Sheet LPCB219 - REMOTE ACCEL IF.SchDoc
size A3; Address1: Factory 10; Address2: 9-13 Dingley Avenue, Dandeong, VICTORIA 3175, AUSTRALIA; DocumentNumber: 7; Revision: 1; SheetNumber: 7; SheetTotal: 7; Lockie__PCB_SUB_ASSEMBLY: Remote Accel Interface; Lockie__PCB_ASSEMBLY: Main; Lockie__LDL: LPCB219; Lockie__PCB_DESCRIPTION: Control Node
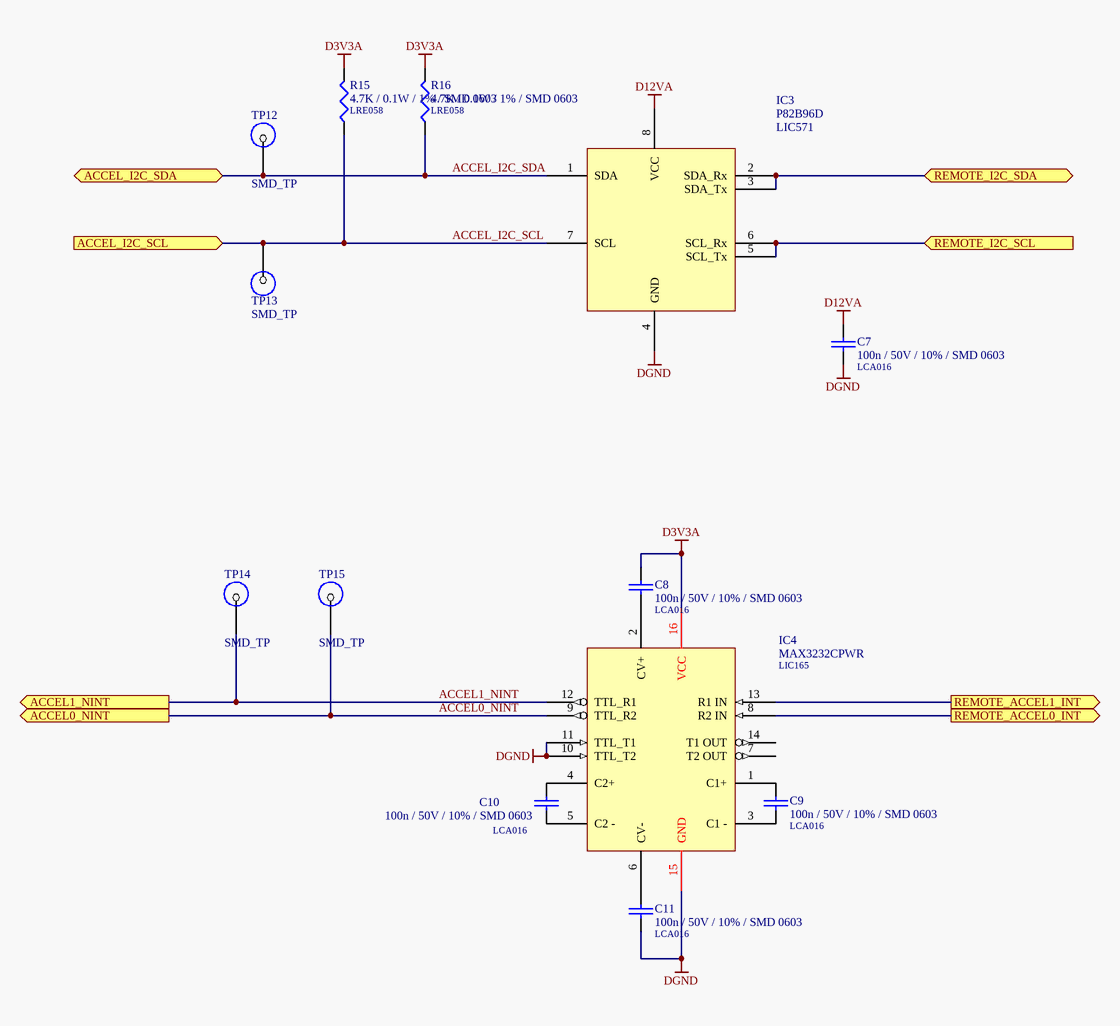
[diagram p6: LPCB219 - REMOTE ACCEL IF.SchDoc]

### Parts
C7  100n / 50V / 10% / SMD 0603  LDL_NUMBER: LCA016  [LFP011__CC1608-0603-IPC7351_B]
C8  100n / 50V / 10% / SMD 0603  LDL_NUMBER: LCA016  [LFP011__CC1608-0603-IPC7351_B]
C9  100n / 50V / 10% / SMD 0603  LDL_NUMBER: LCA016  [LFP011__CC1608-0603-IPC7351_B]
C10  100n / 50V / 10% / SMD 0603  LDL_NUMBER: LCA016  [LFP011__CC1608-0603-IPC7351_B]
C11  100n / 50V / 10% / SMD 0603  LDL_NUMBER: LCA016  [LFP011__CC1608-0603-IPC7351_B]
IC3  P82B96D  LDL_NUMBER: LIC571  [LFP097__SOIC150-8]
IC4  MAX3232CPWR  LDL_NUMBER: LIC165  [LFP049__TSSOP-16]
R15  4.7K / 0.1W / 1% / SMD 0603  LDL_NUMBER: LRE058  [LFP020__CR1608-0603-IPC7351_B]
R16  4.7K / 0.1W / 1% / SMD 0603  LDL_NUMBER: LRE058  [LFP020__CR1608-0603-IPC7351_B]
TP12  SMD_TP  [SMD-TP]  (no BOM)
TP13  SMD_TP  [SMD-TP]  (no BOM)
TP14  SMD_TP  [SMD-TP]  (no BOM)
TP15  SMD_TP  [SMD-TP]  (no BOM)

### Ports
ACCEL0_NINT (out), ACCEL1_NINT (out), ACCEL_I2C_SCL (in), ACCEL_I2C_SDA (bidir), REMOTE_ACCEL0_INT (out), REMOTE_ACCEL1_INT (out), REMOTE_I2C_SCL (in), REMOTE_I2C_SDA (bidir)

### Nets
D3V3A: C8.1 IC4.16(VCC) R15.2 R16.2
D12VA: C7.1 IC3.8(VCC)
DGND: C7.2 C11.2 IC3.4(GND) IC4.10(TTL_T2) IC4.11(TTL_T1) IC4.15(GND)
ACCEL0_NINT: IC4.9(TTL_R2) TP15.1 ; port ACCEL0_NINT
ACCEL1_NINT: IC4.12(TTL_R1) TP14.1 ; port ACCEL1_NINT
ACCEL_I2C_SCL: IC3.7(SCL) R15.1 TP13.1 ; port ACCEL_I2C_SCL
ACCEL_I2C_SDA: IC3.1(SDA) R16.1 TP12.1 ; port ACCEL_I2C_SDA
REMOTE_ACCEL0_INT: IC4.8(R2_IN) ; port REMOTE_ACCEL0_INT
REMOTE_ACCEL1_INT: IC4.13(R1_IN) ; port REMOTE_ACCEL1_INT
REMOTE_I2C_SCL: IC3.5(SCL_Tx) IC3.6(SCL_Rx) ; port REMOTE_I2C_SCL
REMOTE_I2C_SDA: IC3.2(SDA_Rx) IC3.3(SDA_Tx) ; port REMOTE_I2C_SDA
NetC8_2: C8.2 IC4.2(CV+)
NetC9_1: C9.1 IC4.1(C1+)
NetC9_2: C9.2 IC4.3(C1_-)
NetC10_1: C10.1 IC4.4(C2+)
NetC10_2: C10.2 IC4.5(C2_-)
NetC11_1: C11.1 IC4.6(CV-)

Not connected (* = marked no-connect by the designer): IC4 7(T2_OUT) 14(T1_OUT)

### Notes on the sheet
- PCB COMPONENT DESCRIPTION
- LDL NUMBER
- Assembly Details
- Size
- Drawing File Name
- Revision
- http://rloop.org
- Scale
- A3
- Sheet Details
- N.T.S
- Sheet:
- Of:

### Library data of the parts
C7 = 100n / 50V / 10% / SMD 0603: as C1 on sheet LPCB219 - LASER CHANNEL; Value: 100n; FMEDA__FUNCTION_IN_SYSTEM: *; FMEDA__OPERATING__VOLTAGE_TYP: 3.3
C8-C11 = 100n / 50V / 10% / SMD 0603: Capacitor, Ceramic Chip, 100nF, 50V, 10%, SMD 0603; FMEDA__OPERATING__VOLTAGE_MIN: 0; FMEDA__OPERATING__VOLTAGE_MAX: 3.3; FMEDA__OPERATING__TEMP_MIN: -20; FMEDA__OPERATING__TEMP_TYP: 27; FMEDA__OPERATING__TEMP_MAX: 50; FMEDA__CHANNEL: COM; Value: 100n; FMEDA__FUNCTION_IN_SYSTEM: *; FMEDA__OPERATING__VOLTAGE_TYP: 3.3
IC3 = P82B96D: IC, I2C Line Driver [LIC571]
IC4 = MAX3232CPWR: IC, RS232 Line Driver, 3.3V, SMD TSSOP16; FMEDA__OPERATING__TEMP_MAX: 50; FMEDA__OPERATING__TEMP_MIN: -20; FMEDA__OPERATING__TEMP_TYP: 27; FMEDA__CHANNEL: COM; FMEDA__OPERATING__VOLTAGE_MAX: 3.3; FMEDA__OPERATING__VOLTAGE_MIN: 0; FMEDA__FUNCTION_IN_SYSTEM: *; FMEDA__OPERATING__VOLTAGE_TYP: 3.3
R15 R16 = 4.7K / 0.1W / 1% / SMD 0603: Resistor, Ceramic Chip, 4K7, 0.1W, 1%, SMD 0603 [LRE058]; FMEDA__OPERATING__POWER_MAX: 0; FMEDA__OPERATING__TEMP_MAX: 50; FMEDA__OPERATING__TEMP_MIN: -20; FMEDA__OPERATING__TEMP_TYP: 27; FMEDA__CHANNEL: COM; VALUE: 4.7K; FMEDA__OPERATING__POWER_MIN: 0; FMEDA__OPERATING__VOLTAGE_MAX: 0; FMEDA__OPERATING__VOLTAGE_MIN: 0; FMEDA__OPERATING__VOLTAGE_TYP: 0; FMEDA__FUNCTION_IN_SYSTEM: *
TP12-TP15 = SMD_TP: as TP4 on sheet LPCB219 - LASER CHANNEL; FMEDA__OPERATING__CURRENT_MIN: 0; FMEDA__OPERATING__CURRENT_TYP: 0; FMEDA__OPERATING__VOLTAGE_MIN: 0

## Nets that join several sheets
D3V3A: LPCB219 - LASER DISTANCE (7 pins), LPCB219 - NODE CORE (6 pins), LPCB219 - REMOTE ACCEL IF (C8.1 IC4.16 R15.2 R16.2)
D12VA: LPCB219 - OVERVIEW (CN1.1), LPCB219 - NODE CORE (CN4.D12V1 CN4.D12V2), LPCB219 - REMOTE ACCEL IF (C7.1 IC3.8)
DGND: LPCB219 - OVERVIEW (6 pins), U_LPCB219 - LASER INTERFACE/L1 (C1_L1.2 CN2_L1.7 CN2_L1.8 IC1_L1.4), U_LPCB219 - LASER INTERFACE/L2 (C1_L2.2 CN2_L2.7 CN2_L2.8 IC1_L2.4), U_LPCB219 - LASER INTERFACE/L3 (C1_L3.2 CN2_L3.7 CN2_L3.8 IC1_L3.4), LPCB219 - REFLECT SENSORS (11 pins), LPCB219 - LASER DISTANCE (7 pins), LPCB219 - NODE CORE (CN4.GND1 CN4.GND2 CN4.GND3 CN4.GND4), LPCB219 - REMOTE ACCEL IF (6 pins)
P5VA: LPCB219 - OVERVIEW (CN1.2), U_LPCB219 - LASER INTERFACE/L1 (C1_L1.1 IC1_L1.1), U_LPCB219 - LASER INTERFACE/L2 (C1_L2.1 IC1_L2.1), U_LPCB219 - LASER INTERFACE/L3 (C1_L3.1 IC1_L3.1), LPCB219 - REFLECT SENSORS (R9.2 R11.2 R14.2), LPCB219 - NODE CORE (CN4.P5V1 CN4.P5V2)
P24VA: U_LPCB219 - LASER INTERFACE/L1 (CN2_L1.1), U_LPCB219 - LASER INTERFACE/L2 (CN2_L2.1), U_LPCB219 - LASER INTERFACE/L3 (CN2_L3.1), LPCB219 - REFLECT SENSORS (CN6.1 CN7.1 CN8.1), LPCB219 - LASER DISTANCE (CN3.1), LPCB219 - NODE CORE (CN4.P24V1 CN4.P24V2)
ACCEL0_NINT: LPCB219 - NODE CORE (CN4.T14), LPCB219 - REMOTE ACCEL IF (IC4.9 TP15.1)
ACCEL1_NINT: LPCB219 - NODE CORE (CN4.T15), LPCB219 - REMOTE ACCEL IF (IC4.12 TP14.1)
ACCEL_I2C_SCL: LPCB219 - NODE CORE (CN4.SCL), LPCB219 - REMOTE ACCEL IF (IC3.7 R15.1 TP13.1)
ACCEL_I2C_SDA: LPCB219 - NODE CORE (CN4.SDA), LPCB219 - REMOTE ACCEL IF (IC3.1 R16.1 TP12.1)
LASER_NCS: LPCB219 - LASER DISTANCE (IC2.18 TP6.1), LPCB219 - NODE CORE (CN4.T21)
LASER_RX1: U_LPCB219 - LASER INTERFACE/L1 (R6_L1.1 TP4_L1.1), LPCB219 - NODE CORE (CN4.T0)
LASER_RX2: U_LPCB219 - LASER INTERFACE/L2 (R6_L2.1 TP4_L2.1), LPCB219 - NODE CORE (CN4.T7)
LASER_RX3: U_LPCB219 - LASER INTERFACE/L3 (R6_L3.1 TP4_L3.1), LPCB219 - NODE CORE (CN4.T9)
LASER_SPI_MISO: LPCB219 - LASER DISTANCE (IC2.16 TP9.1), LPCB219 - NODE CORE (CN4.T12)
LASER_SPI_MOSI: LPCB219 - LASER DISTANCE (IC2.15 TP8.1), LPCB219 - NODE CORE (CN4.T11)
LASER_SPI_SCK: LPCB219 - LASER DISTANCE (IC2.17 TP10.1), LPCB219 - NODE CORE (CN4.T13)
LASER_TX1: U_LPCB219 - LASER INTERFACE/L1 (IC1_L1.3 TP5_L1.1), LPCB219 - NODE CORE (CN4.T1)
LASER_TX2: U_LPCB219 - LASER INTERFACE/L2 (IC1_L2.3 TP5_L2.1), LPCB219 - NODE CORE (CN4.T8)
LASER_TX3: U_LPCB219 - LASER INTERFACE/L3 (IC1_L3.3 TP5_L3.1), LPCB219 - NODE CORE (CN4.T10)
NetCN4_T20: LPCB219 - REFLECT SENSORS (R10.1 TP1.1), LPCB219 - NODE CORE (CN4.T20)
NetCN4_T22: LPCB219 - LASER DISTANCE (IC2.19 R7.1 TP7.1), LPCB219 - NODE CORE (CN4.T22)
NetCN4_T24: LPCB219 - REFLECT SENSORS (R12.1 TP2.1), LPCB219 - NODE CORE (CN4.T24)
NetCN4_T27: LPCB219 - REFLECT SENSORS (R13.1 TP3.1), LPCB219 - NODE CORE (CN4.T27)
REMOTE_ACCEL0_INT: LPCB219 - OVERVIEW (CN5.5), LPCB219 - REMOTE ACCEL IF (IC4.8)
REMOTE_ACCEL1_INT: LPCB219 - OVERVIEW (CN5.7), LPCB219 - REMOTE ACCEL IF (IC4.13)
REMOTE_I2C_SCL: LPCB219 - OVERVIEW (CN5.3), LPCB219 - REMOTE ACCEL IF (IC3.5 IC3.6)
REMOTE_I2C_SDA: LPCB219 - OVERVIEW (CN5.1), LPCB219 - REMOTE ACCEL IF (IC3.2 IC3.3)